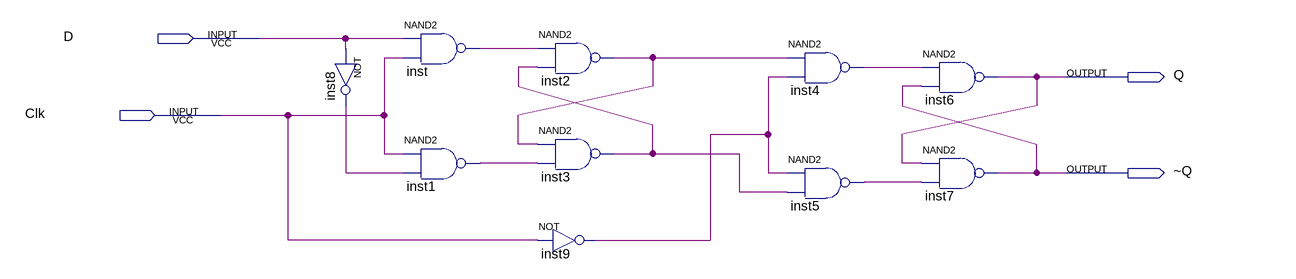
[diagram p0: schematic sheet]
// Quartus schematic lab9step3a.bdf as structural Verilog: 10 symbols, 4 pins
module lab9step3a (
  input  D,
  input  Clk,
  output Q,
  output \~Q 
);

  wire inst1_out, inst2_out, inst3_out, inst4_out, inst5_out, inst8_out, inst9_out, inst_out;

  not inst8 (inst8_out, D);
  nand inst (inst_out, D, Clk);
  nand inst1 (inst1_out, Clk, inst8_out);
  nand inst2 (inst2_out, inst_out, inst3_out);
  nand inst3 (inst3_out, inst2_out, inst1_out);
  not inst9 (inst9_out, Clk);
  nand inst4 (inst4_out, inst2_out, inst9_out);
  nand inst5 (inst5_out, inst9_out, inst3_out);
  nand inst6 (Q, inst4_out, \~Q );
  nand inst7 (\~Q , Q, inst5_out);
endmodule
